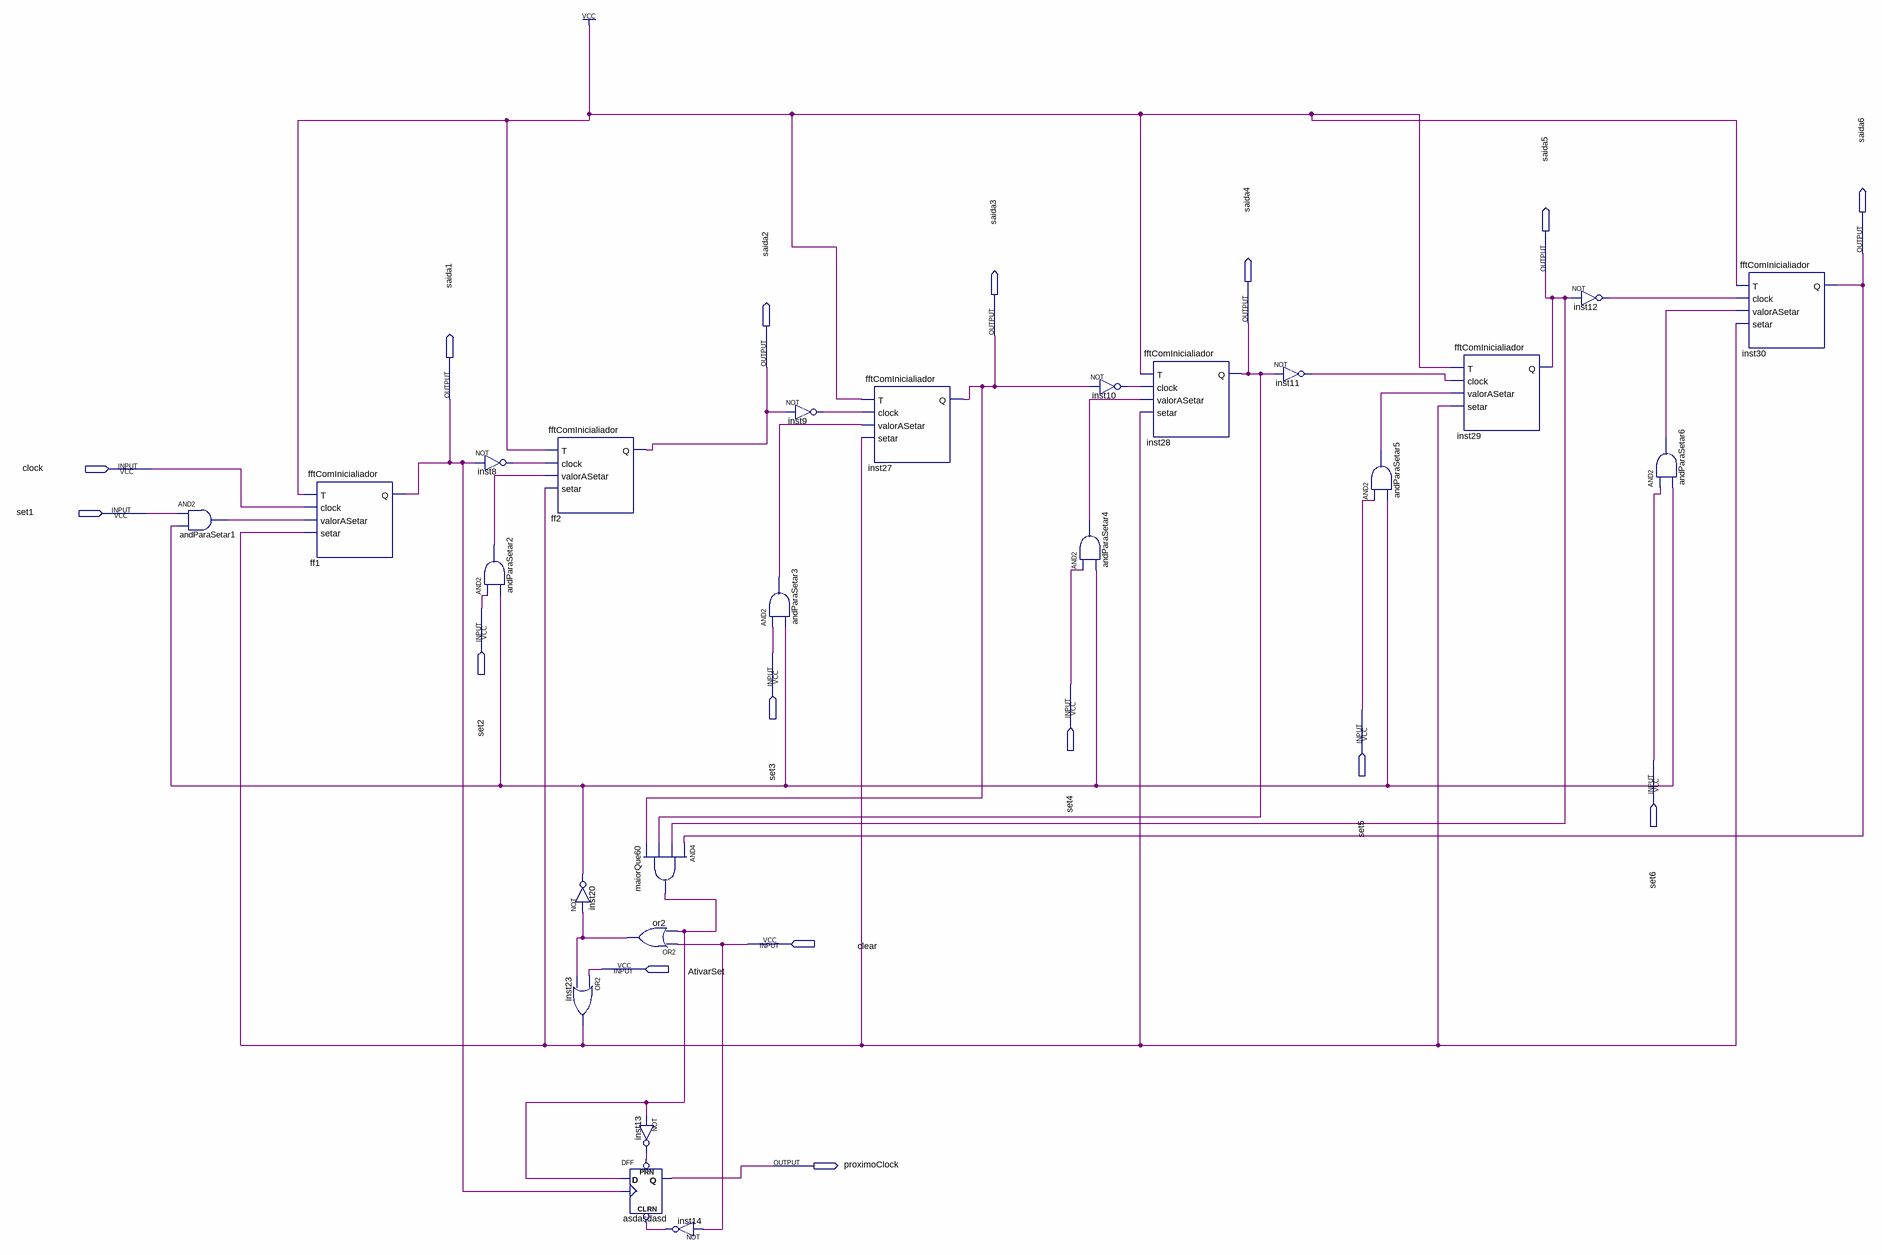
[diagram p0: schematic sheet]
// Quartus schematic ContadorDe0A60ComInicializador.bdf as structural Verilog: 24 symbols, 16 pins
module ContadorDe0A60ComInicializador (
  input  clock,
  input  set1,
  input  set2,
  input  set3,
  input  set4,
  input  set5,
  input  set6,
  input  clear,
  input  AtivarSet,
  output saida6,
  output saida5,
  output saida4,
  output saida3,
  output saida2,
  output saida1,
  output proximoClock
);

  wire andParaSetar1_out, andParaSetar2_out, andParaSetar3_out, andParaSetar4_out, andParaSetar5_out,
       andParaSetar6_out, inst8_out, inst9_out, inst10_out, inst11_out, inst12_out, inst13_out, inst14_out,
       inst20_out, inst23_out, maiorQue60_out, or2_out;

  and andParaSetar1 (andParaSetar1_out, set1, inst20_out);
  fftComInicialiador ff1 (.T(1'b1), .clock(clock), .valorASetar(andParaSetar1_out), .setar(inst23_out), .Q(saida1));
  not inst8 (inst8_out, saida1);
  and andParaSetar2 (andParaSetar2_out, set2, inst20_out);
  fftComInicialiador ff2 (.T(1'b1), .clock(inst8_out), .valorASetar(andParaSetar2_out), .setar(inst23_out), .Q(saida2));
  not inst20 (inst20_out, or2_out);
  or inst23 (inst23_out, AtivarSet, or2_out);
  and maiorQue60 (maiorQue60_out, saida6, saida5, saida4, saida3);
  or or2 (or2_out, clear, maiorQue60_out);
  not inst13 (inst13_out, maiorQue60_out);
  DFF asdasdasd (.CLRN(inst14_out), .CLK(saida1), .D(maiorQue60_out), .PRN(inst13_out), .Q(proximoClock));
  not inst14 (inst14_out, clear);
  and andParaSetar3 (andParaSetar3_out, set3, inst20_out);
  not inst9 (inst9_out, saida2);
  fftComInicialiador inst27 (
    .T(1'b1), .clock(inst9_out), .valorASetar(andParaSetar3_out), .setar(inst23_out), .Q(saida3));
  not inst10 (inst10_out, saida3);
  and andParaSetar4 (andParaSetar4_out, set4, inst20_out);
  fftComInicialiador inst28 (
    .T(1'b1), .clock(inst10_out), .valorASetar(andParaSetar4_out), .setar(inst23_out), .Q(saida4));
  not inst11 (inst11_out, saida4);
  and andParaSetar5 (andParaSetar5_out, set5, inst20_out);
  fftComInicialiador inst29 (
    .T(1'b1), .clock(inst11_out), .valorASetar(andParaSetar5_out), .setar(inst23_out), .Q(saida5));
  not inst12 (inst12_out, saida5);
  and andParaSetar6 (andParaSetar6_out, set6, inst20_out);
  fftComInicialiador inst30 (
    .T(1'b1), .clock(inst12_out), .valorASetar(andParaSetar6_out), .setar(inst23_out), .Q(saida6));
endmodule
